# EAGLE design M220p16 (EAGLE 6.6.0)
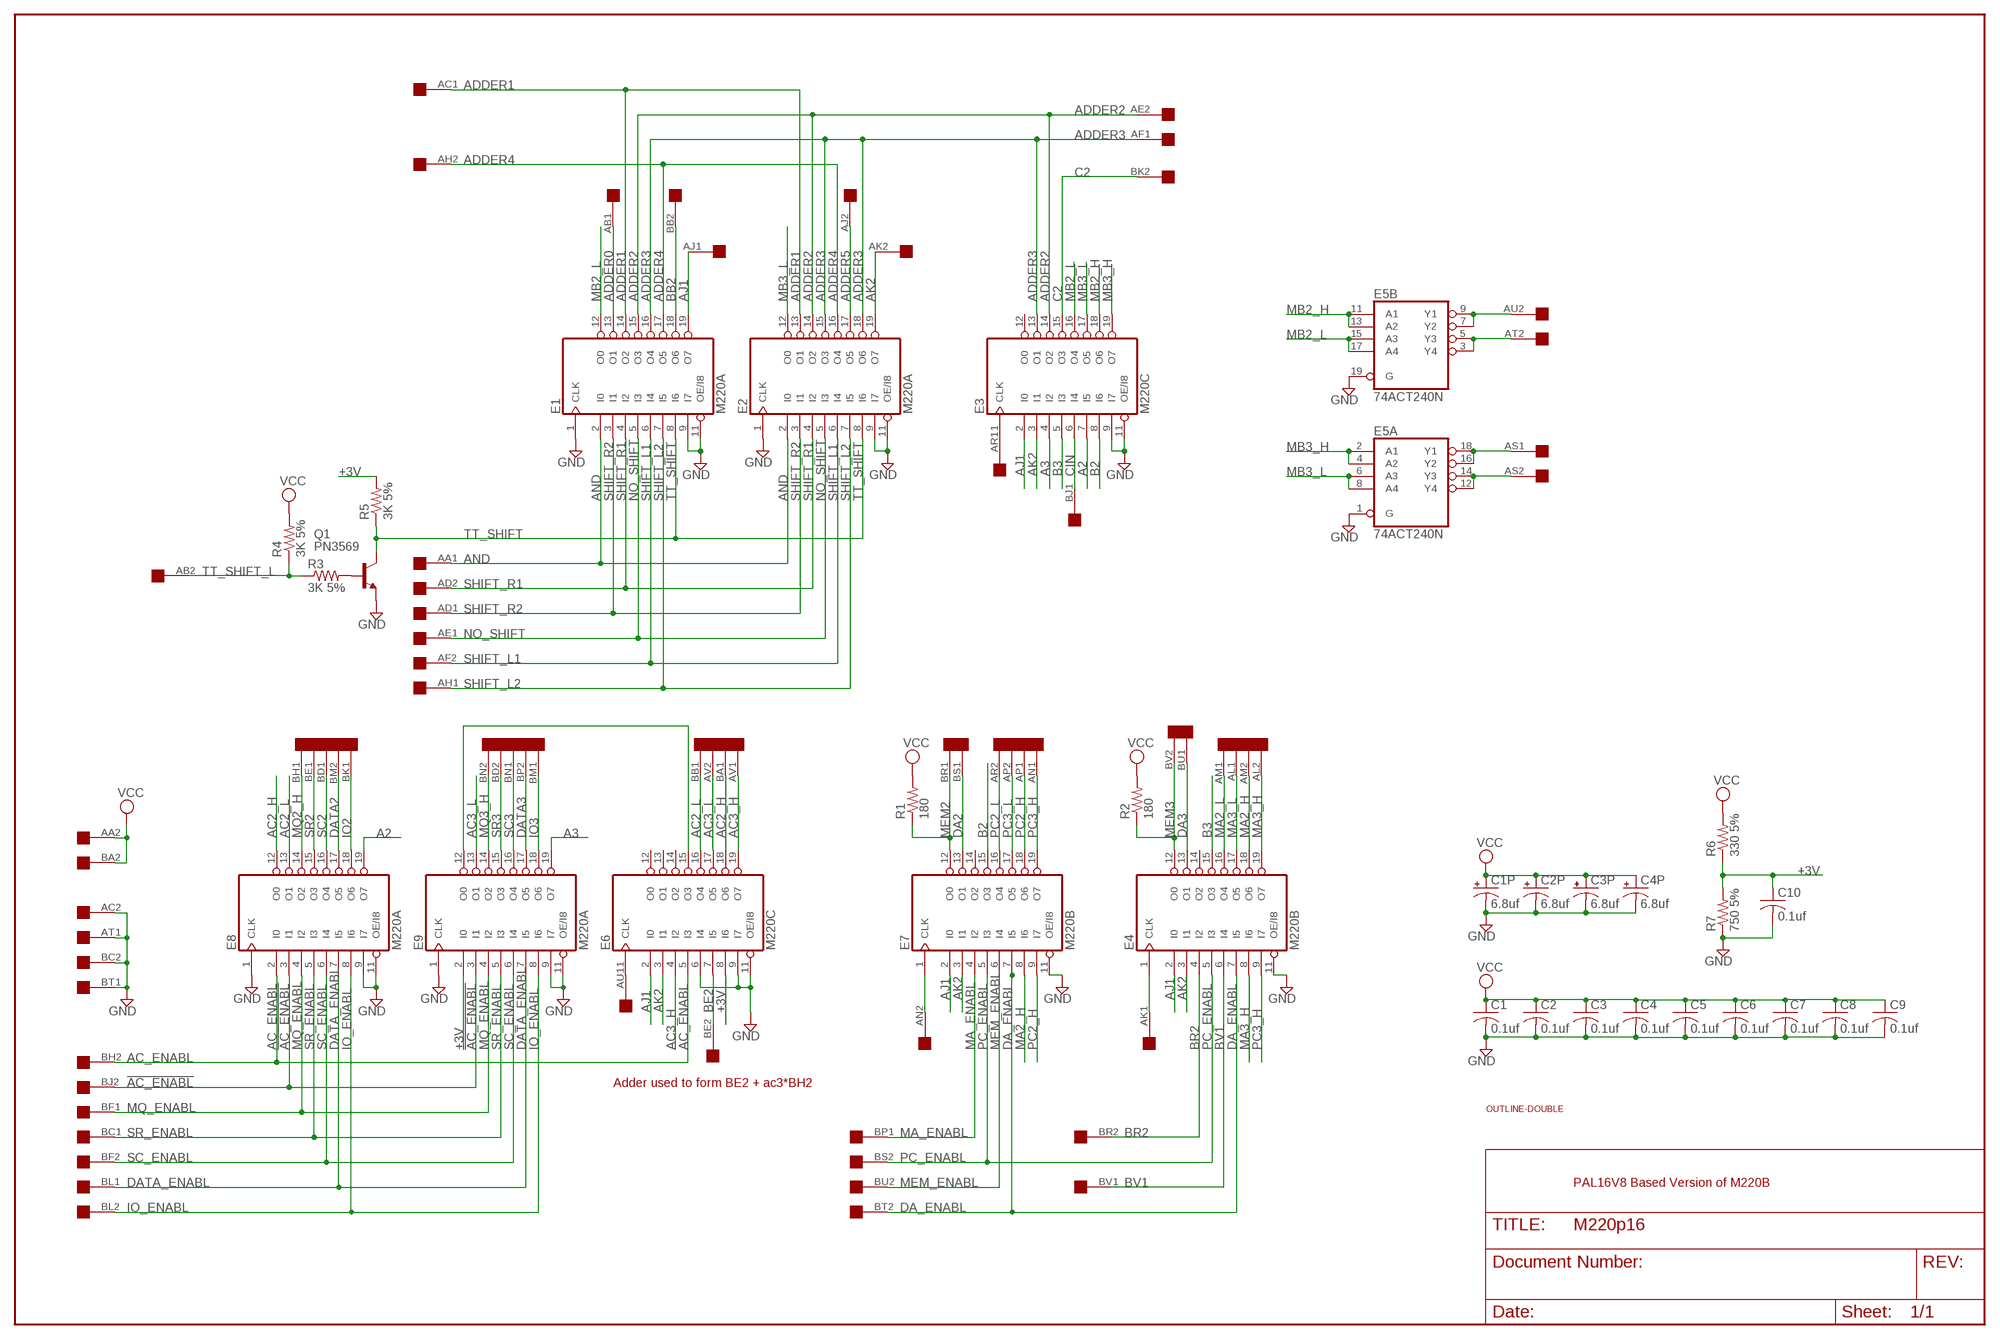
[diagram p0: schematic, sheet 1]

## Parts
C1  0.1uf  C-US050-025X075  [C050-025X075]
C1P  6.8uf  CPOL-USE15-5AXIAL  [E15-5]
C2  0.1uf  C-US050-025X075  [C050-025X075]
C2P  6.8uf  CPOL-USE15-5AXIAL  [E15-5]
C3  0.1uf  C-US050-025X075  [C050-025X075]
C3P  6.8uf  CPOL-USE15-5AXIAL  [E15-5]
C4  0.1uf  C-US050-025X075  [C050-025X075]
C4P  6.8uf  CPOL-USE15-5AXIAL  [E15-5]
C5  0.1uf  C-US050-025X075  [C050-025X075]
C6  0.1uf  C-US050-025X075  [C050-025X075]
C7  0.1uf  C-US050-025X075  [C050-025X075]
C8  0.1uf  C-US050-025X075  [C050-025X075]
C9  0.1uf  C-US050-025X075  [C050-025X075]
C10  0.1uf  C-US050-025X075  [C050-025X075]
E1  M220A  16V8  [DIL20]
E2  M220A  16V8  [DIL20]
E3  M220C  16V8  [DIL20]
E4  M220B  16V8  [DIL20]
E5  74ACT240N  74S240N  [DIL20]
E6  M220C  16V8  [DIL20]
E7  M220B  16V8  [DIL20]
E8  M220A  16V8  [DIL20]
E9  M220A  16V8  [DIL20]
Q1  PN3569  2N2102  [TO5]
R1  180  R-US_0207/10  [0207/10]
R2  180  R-US_0207/10  [0207/10]
R3  3K 5%  R-US_0207/10  [0207/10]
R4  3K 5%  R-US_0207/10  [0207/10]
R5  3K 5%  R-US_0207/10  [0207/10]
R6  330 5%  R-US_0207/10  [0207/10]
R7  750 5%  R-US_0207/10  [0207/10]
U$1  DOUBLE  [EDGE-CON4]
U$2  OUTLINE-DOUBLE  [DOUBLE]

## Nets
!AC_ENABL: E8.3(I1) E9.3(I1) U$1.BJ2
+3V [Supply]: C10.1 E6.8(I6) E9.2(I0) R5.2 R6.1 R7.2
A2: E3.7(I5) E8.19(O7)
A3 [Supply]: E3.4(I2) E9.19(O7)
AC2_H: E6.18(O6) E8.12(O0) U$1.BA1
AC2_L: E6.16(O4) E8.13(O1) U$1.BB1
AC3_H: E6.4(I2) E6.19(O7) U$1.AV1
AC3_L: E6.17(O5) E9.13(O1) U$1.AV2
AC_ENABL: E6.5(I3) E8.2(I0) U$1.BH2
ADDER0: E1.13(O1) U$1.AB1
ADDER1: E1.14(O2) E2.13(O1) U$1.AC1
ADDER2: E1.15(O3) E2.14(O2) E3.14(O2) U$1.AE2
ADDER3: E1.16(O4) E2.15(O3) E2.18(O6) E3.13(O1) U$1.AF1
ADDER4: E1.17(O5) E2.16(O4) U$1.AH2
ADDER5: E2.17(O5) U$1.AJ2
AJ1: E1.19(O7) E3.2(I0) E4.2(I0) E6.2(I0) E7.2(I0) U$1.AJ1
AK2: E2.19(O7) E3.3(I1) E4.3(I1) E6.3(I1) E7.3(I1) U$1.AK2
AND: E1.2(I0) E2.2(I0) U$1.AA1
B2: E3.8(I6) E7.15(O3)
B3: E3.5(I3) E4.15(O3)
BB2: E1.18(O6) U$1.BB2
BE2: E6.7(I5) U$1.BE2
BR2: E4.4(I2) U$1.BR2
BV1: E4.6(I4) U$1.BV1
C2: E3.15(O3) U$1.BK2
CIN: E3.6(I4) U$1.BJ1
DA2: E7.13(O1) U$1.BS1
DA3: E4.13(O1) U$1.BU1
DA_ENABL: E4.7(I5) E7.7(I5) U$1.BT2
DATA2: E8.17(O5) U$1.BM2
DATA3: E9.17(O5) U$1.BP2
DATA_ENABL: E8.7(I5) E9.7(I5) U$1.BL1
GND [Supply]: C1.2 C1P.- C2.2 C2P.- C3.2 C3P.- C4.2 C4P.- C5.2 C6.2 C7.2 C8.2 C9.2 C10.2 E1.1(CLK) E1.9(I7) E1.11(OE/I8) E2.1(CLK) E2.9(I7) E2.11(OE/I8) E3.9(I7) E3.11(OE/I8) E4.11(OE/I8) E5.1(A:G) E5.19(B:G) E6.6(I4) E6.9(I7) E6.11(OE/I8) E7.11(OE/I8) E8.1(CLK) E8.9(I7) E8.11(OE/I8) E9.1(CLK) E9.9(I7) E9.11(OE/I8) Q1.1(E) R7.1 U$1.AC2 U$1.AT1 U$1.BC2 U$1.BT1
IO2: E8.18(O6) U$1.BK1
IO3: E9.18(O6) U$1.BM1
IO_ENABL: E8.8(I6) E9.8(I6) U$1.BL2
MA2_H: E4.18(O6) E7.8(I6) U$1.AM2
MA2_L: E4.16(O4) U$1.AM1
MA3_H: E4.8(I6) E4.19(O7) U$1.AL2
MA3_L: E4.17(O5) U$1.AL1
MA_ENABL: E7.4(I2) U$1.BP1
MB2_H: E3.18(O6) E5.11(B:A1) E5.13(B:A2)
MB2_L: E1.12(O0) E3.16(O4) E5.15(B:A3) E5.17(B:A4)
MB3_H: E3.19(O7) E5.2(A:A1) E5.4(A:A2)
MB3_L: E2.12(O0) E3.17(O5) E5.6(A:A3) E5.8(A:A4)
MEM2: E7.12(O0) R1.1 U$1.BR1
MEM3: E4.12(O0) R2.1 U$1.BV2
MEM_ENABL: E7.6(I4) U$1.BU2
MQ2_H: E8.14(O2) U$1.BH1
MQ3_H: E9.14(O2) U$1.BN2
MQ_ENABL: E8.4(I2) E9.4(I2) U$1.BF1
N$1: E7.1(CLK) U$1.AN2
N$2: E4.1(CLK) U$1.AK1
N$3: E3.1(CLK) U$1.AR1
N$4: E6.1(CLK) U$1.AU1
N$5 [Supply]: E6.15(O3) E9.12(O0)
N$6: E5.12(A:Y4) E5.14(A:Y3) U$1.AS2
N$7: E5.16(A:Y2) E5.18(A:Y1) U$1.AS1
N$8: E5.3(B:Y4) E5.5(B:Y3) U$1.AT2
N$9: E5.7(B:Y2) E5.9(B:Y1) U$1.AU2
N$10: Q1.2(B) R3.2
NO_SHIFT: E1.5(I3) E2.5(I3) U$1.AE1
PC2_H: E7.9(I7) E7.18(O6) U$1.AP1
PC2_L: E7.16(O4) U$1.AR2
PC3_H: E4.9(I7) E7.19(O7) U$1.AN1
PC3_L: E7.17(O5) U$1.AP2
PC_ENABL: E4.5(I3) E7.5(I3) U$1.BS2
SC2: E8.16(O4) U$1.BD1
SC3: E9.16(O4) U$1.BN1
SC_ENABL: E8.6(I4) E9.6(I4) U$1.BF2
SHIFT_L1: E1.6(I4) E2.6(I4) U$1.AF2
SHIFT_L2: E1.7(I5) E2.7(I5) U$1.AH1
SHIFT_R1: E1.4(I2) E2.4(I2) U$1.AD2
SHIFT_R2: E1.3(I1) E2.3(I1) U$1.AD1
SR2: E8.15(O3) U$1.BE1
SR3: E9.15(O3) U$1.BD2
SR_ENABL: E8.5(I3) E9.5(I3) U$1.BC1
TT_SHIFT: E1.8(I6) E2.8(I6) Q1.3(C) R5.1
TT_SHIFT_L: R3.1 R4.1 U$1.AB2
VCC [Supply]: C1.1 C1P.+ C2.1 C2P.+ C3.1 C3P.+ C4.1 C4P.+ C5.1 C6.1 C7.1 C8.1 C9.1 R1.2 R2.2 R4.2 R6.2 U$1.AA2 U$1.BA2
Unconnected: E3.12(O0) E4.14(O2) E6.12(O0) E6.13(O1) E6.14(O2) E7.14(O2)

## Notes on the sheet
- Adder used to form BE2 + ac3*BH2
- PAL16V8 Based Version of M220B

## Power pins joined to a net without a drawn wire
GND: E1.10(GND) E2.10(GND) E3.10(GND) E4.10(GND) E5.10(P:GND) E6.10(GND) E7.10(GND) E8.10(GND) E9.10(GND)
VCC: E1.20(VCC) E2.20(VCC) E3.20(VCC) E4.20(VCC) E5.20(P:VCC) E6.20(VCC) E7.20(VCC) E8.20(VCC) E9.20(VCC)

## Library data of the parts
C1-C10 = rcl:C-US: CAPACITOR, American symbol
C1P C2P C3P C4P = rcl:CPOL-US: POLARIZED CAPACITOR, American symbol
E1-E4 E6-E9 = pal:16V8: PAL; MPN: GAL16V8D-7LPN; OC_FARNELL: 9699740; OC_NEWARK: 97K0449
E5 = 74xx-us:74*240: Octal BUFFER and LINE DRIVER, 3-state
Q1 = transistor:2N2102: NPN TRANSISTOR
R1-R7 = rcl:R-US_: RESISTOR, American symbol
U$1 = dec-con:DOUBLE: Double-Height DEC board
U$2 = dec-con:OUTLINE-*: Board outlines for DEC boards.

## Net classes
1 Supply: width 0.813 mm

## Board
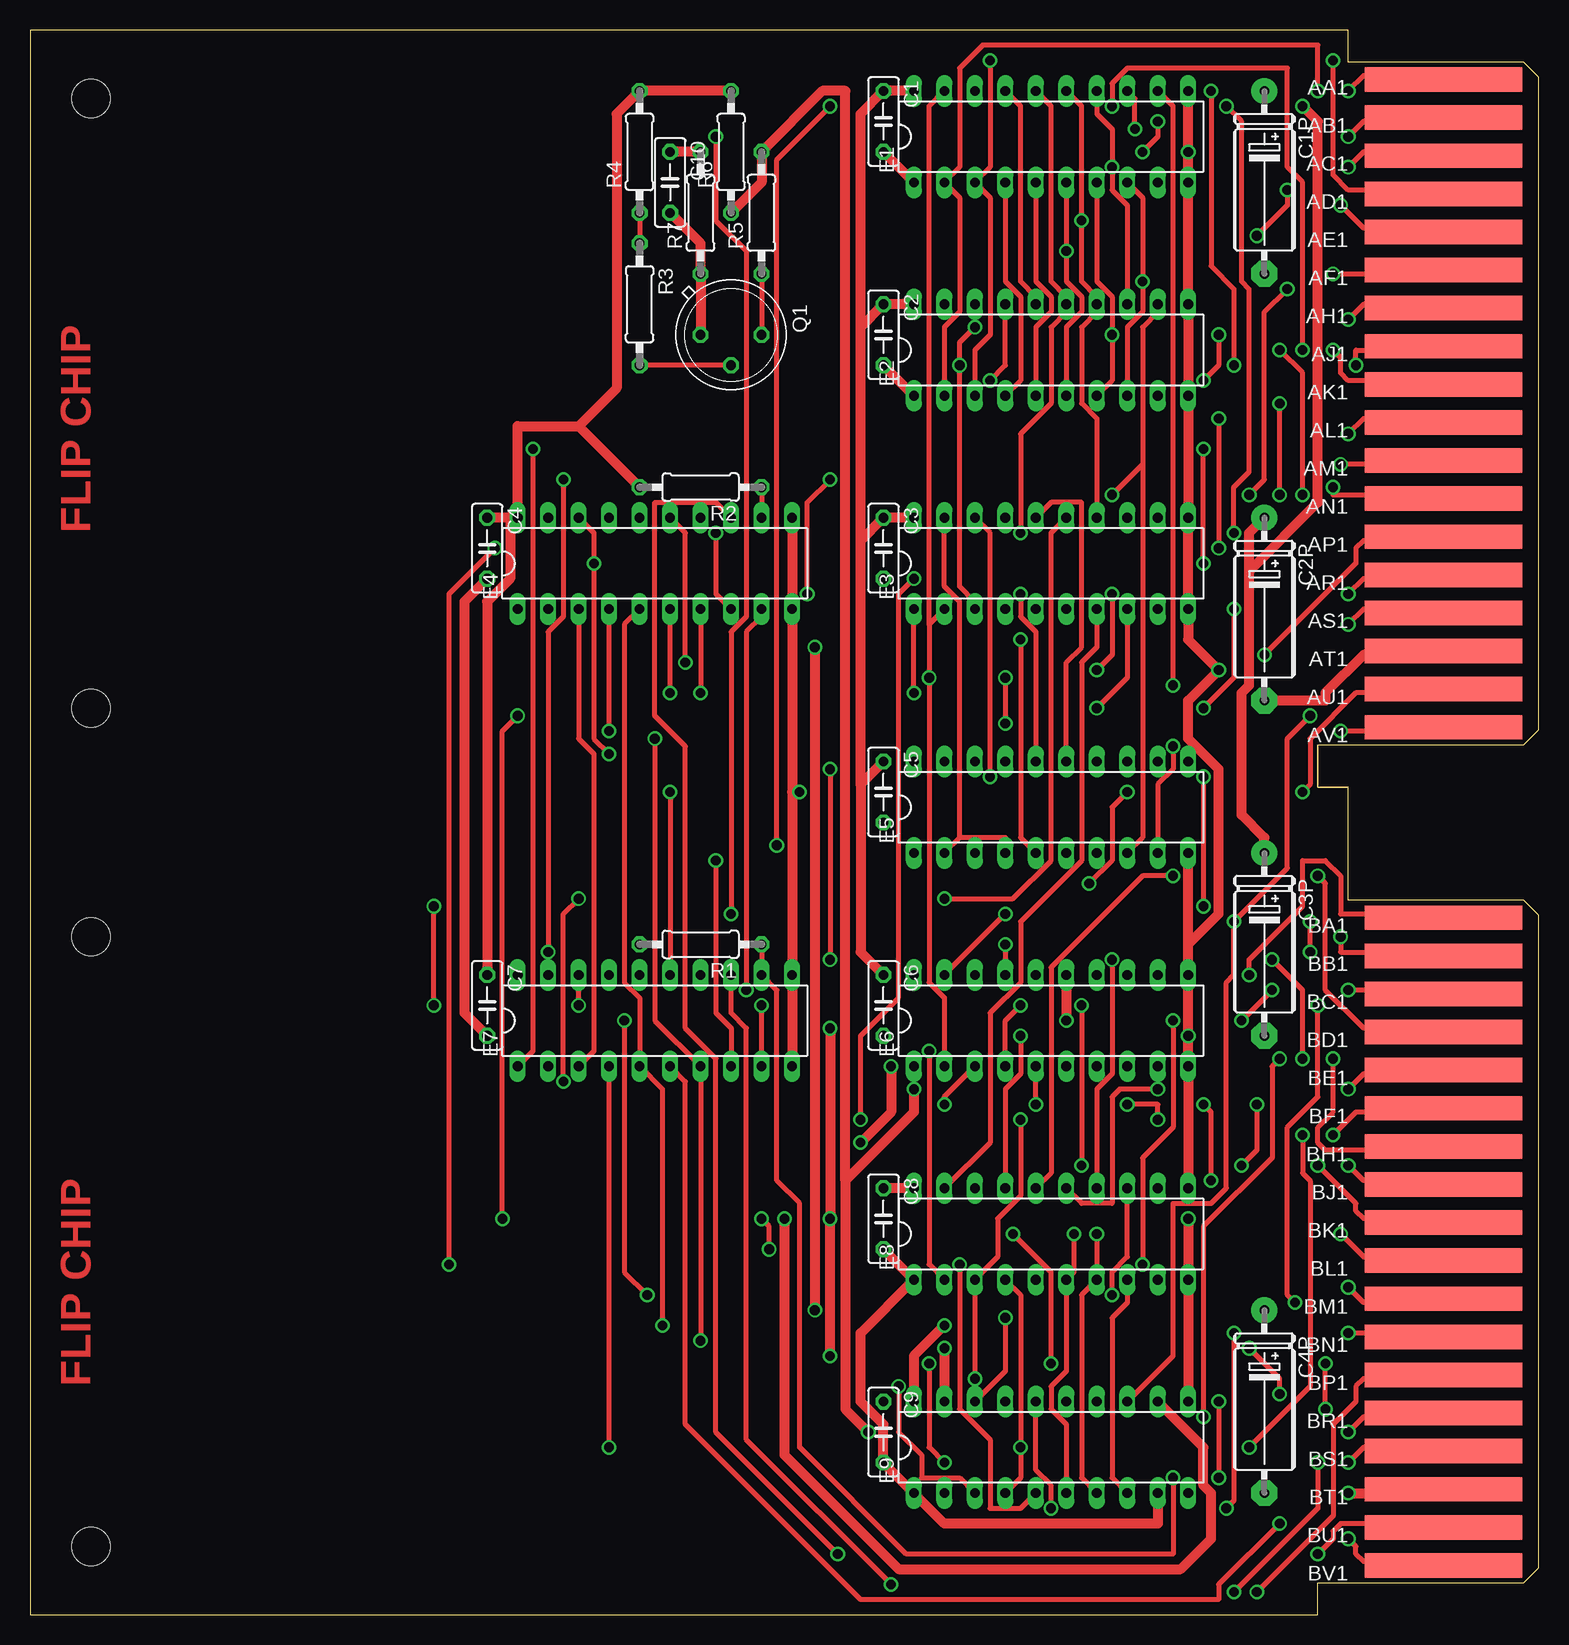
[diagram p1: board, top side]
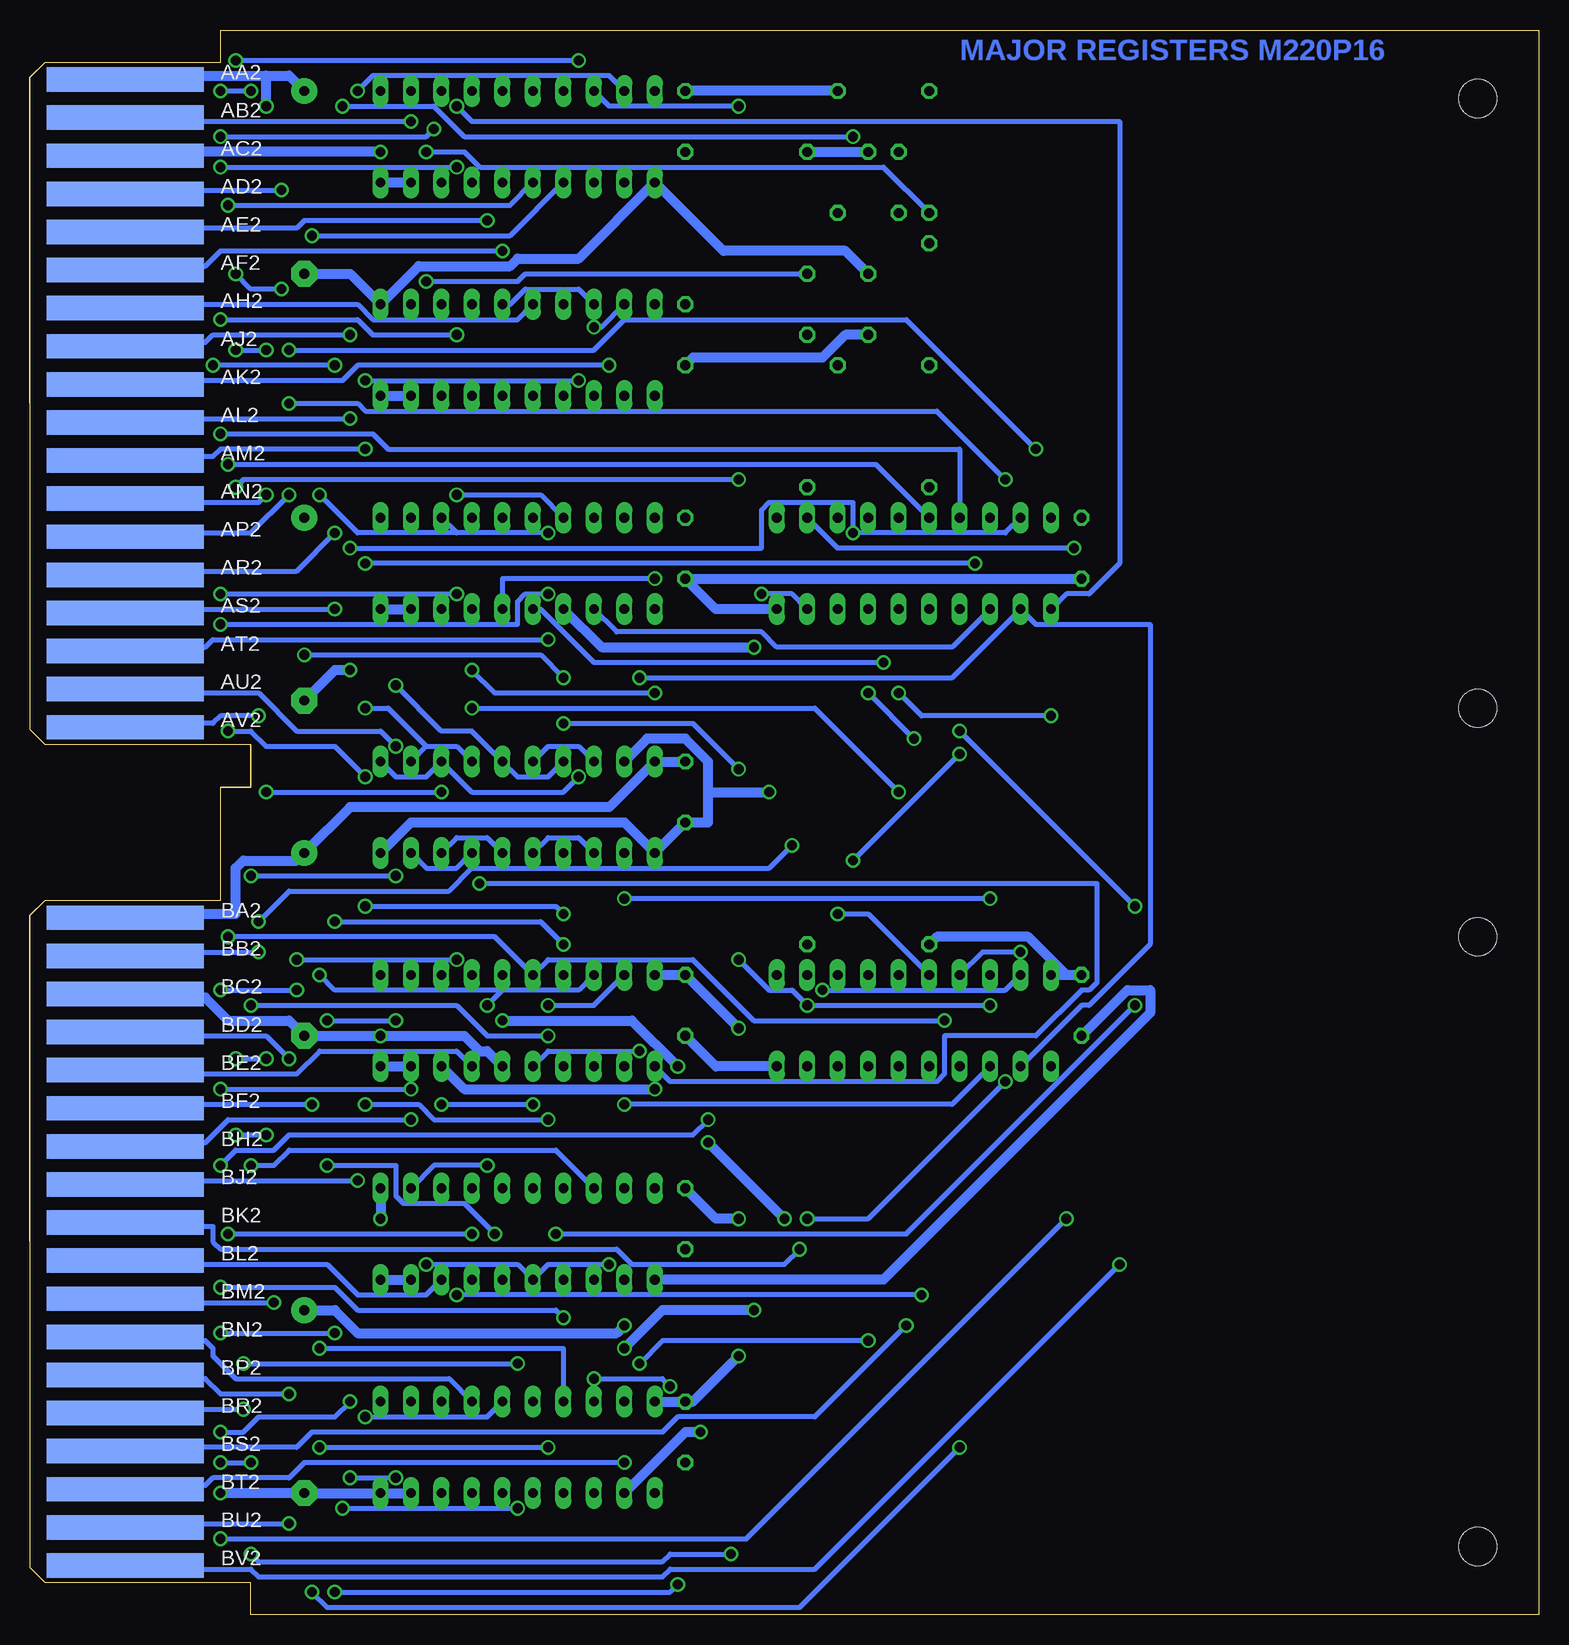
[diagram p2: board, bottom side, seen from below]

Size 125.73 x 132.08 mm. Coordinates in mm from the lower left corner, seen from the top.
Copper layers (1+16): Top 0.035mm / dielectric 1.5mm / Bottom 0.035mm
Design rules "16mils": minimum track width 16mil, minimum drill 32mil, track to track 15mil, track to pad 10mil, pad to pad 10mil, via to via 10mil, smd to smd 10mil, copper to edge 13mil, drill to drill 10mil, minimum pad ring 10mil, minimum via ring 8mil, stop-mask expansion 0mil, vias tented up to drill 0mil, thermal gap 10mil

### Footprints (pad centres in the part's own frame; a part is rotated, then mirrored left to right if it is on the bottom)
C050-025X075 = drill 0.813 octagon: 1 -2.54,0; 2 2.54,0
E15-5 = drill 0.813 pad 2.159: + -7.62,0 | drill 0.813 pad 2.159 octagon: - 7.62,0
DIL20 = drill 0.813 long: 1 -11.43,-3.81; 2 -8.89,-3.81; 3 -6.35,-3.81; 4 -3.81,-3.81; 5 -1.27,-3.81; 6 1.27,-3.81; 7 3.81,-3.81; 8 6.35,-3.81; 9 8.89,-3.81; 10 11.43,-3.81; 11 11.43,3.81; 12 8.89,3.81; 13 6.35,3.81; 14 3.81,3.81; 15 1.27,3.81; 16 -1.27,3.81; 17 -3.81,3.81; 18 -6.35,3.81; 19 -8.89,3.81; 20 -11.43,3.81
TO5 = drill 0.813 octagon: 1 0,-2.54; 2 2.54,0; 3 0,2.54
0207/10 = drill 0.813 octagon: 1 -5.08,0; 2 5.08,0
EDGE-CON4 = smd 13.106 x 2.032: AA1 7.938,4.128; AB1 7.938,7.303; AC1 7.938,10.477; AD1 7.938,13.652; AE1 7.938,16.828; AF1 7.938,20.003; AH1 7.938,23.177; AJ1 7.938,26.352; AK1 7.938,29.527; AL1 7.938,32.703; AM1 7.938,35.877; AN1 7.938,39.053; AP1 7.938,42.227; AR1 7.938,45.403; AS1 7.938,48.578; AT1 7.938,51.752; AU1 7.938,54.928; AV1 7.938,58.102; BA1 7.938,73.978; BB1 7.938,77.153; BC1 7.938,80.328; BD1 7.938,83.502; BE1 7.938,86.677; BF1 7.938,89.853; BH1 7.938,93.028; BJ1 7.938,96.203; BK1 7.938,99.377; BL1 7.938,102.552; BM1 7.938,105.728; BN1 7.938,108.903; BP1 7.938,112.078; BR1 7.938,115.252; BS1 7.938,118.427; BT1 7.938,121.603; BU1 7.938,124.778; BV1 7.938,127.953 | smd 13.106 x 2.032 bottom: AA2 7.938,4.128; AB2 7.938,7.303; AC2 7.938,10.477; AD2 7.938,13.652; AE2 7.938,16.828; AF2 7.938,20.003; AH2 7.938,23.177; AJ2 7.938,26.352; AK2 7.938,29.527; AL2 7.938,32.703; AM2 7.938,35.877; AN2 7.938,39.053; AP2 7.938,42.227; AR2 7.938,45.403; AS2 7.938,48.578; AT2 7.938,51.752; AU2 7.938,54.928; AV2 7.938,58.102; BA2 7.938,73.978; BB2 7.938,77.153; BC2 7.938,80.328; BD2 7.938,83.502; BE2 7.938,86.677; BF2 7.938,89.853; BH2 7.938,93.028; BJ2 7.938,96.203; BK2 7.938,99.377; BL2 7.938,102.552; BM2 7.938,105.728; BN2 7.938,108.903; BP2 7.938,112.078; BR2 7.938,115.252; BS2 7.938,118.427; BT2 7.938,121.603; BU2 7.938,124.778; BV2 7.938,127.953
DOUBLE = hole 3.175: 120.65,56.515; 120.65,5.715; 120.65,75.565; 120.65,126.365

### Placement (x,y rotation side)
C1  71.12,124.46 270 top
C1P  102.87,119.38 270 top
C2  71.12,106.68 270 top
C2P  102.87,83.82 270 top
C3  71.12,88.9 270 top
C3P  102.87,55.88 270 top
C4  38.1,88.9 270 top
C4P  102.87,17.78 270 top
C5  71.12,68.58 270 top
C6  71.12,50.8 270 top
C7  38.1,50.8 270 top
C8  71.12,33.02 270 top
C9  71.12,15.24 270 top
C10  53.34,119.38 270 top
E1  85.09,123.19 0 top
E2  85.09,105.41 0 top
E3  85.09,87.63 0 top
E4  52.07,87.63 0 top
E5  85.09,67.31 0 top
E6  85.09,49.53 0 top
E7  52.07,49.53 0 top
E8  85.09,31.75 0 top
E9  85.09,13.97 0 top
Q1  58.42,106.68 270 top
R1  55.88,55.88 180 top
R2  55.88,93.98 180 top
R3  50.8,109.22 270 top
R4  50.8,121.92 90 top
R5  60.96,116.84 90 top
R6  58.42,121.92 90 top
R7  55.88,116.84 90 top
U$1  125.73,132.08 180 top
U$2  125.73,132.08 180 top
U$3  [FLIPCHIP]  0,0 0 top
U$4  [FLIPCHIP]  0,71.12 0 top

### Tracks (layer width: path | path; a pad name or v marks a point on that pad's centre or on a via)
!AC_ENABL  (via drill 0.81)
  Top 0.406: E9.3 77.47,11.43 74.3,11.43 74.3,13.34 72.39,15.24 v72.39,19.05 | v78.74,19.68 E8.3 80.64,29.84 80.64,33.02 82.55,34.92 v82.55,41.27 | v97.79,42.55 98.42,41.91 v98.42,36.2
  Bottom 0.406: v72.39,19.05 73.03,19.68 v78.74,19.68 | v82.55,41.27 92.08,41.27 93.34,42.55 v97.79,42.55 | v98.42,36.2 117.47,36.2 U$1.BJ2
+3V  (via drill 0.81)
  Top 0.813: R7.2 C10.1 | R6.1 60.96,119.38 R5.2 66.04,127 67.94,127 67.94,36.2 | v69.85,15.24 67.94,17.14 67.94,36.2 | 67.94,36.2 73.66,41.91 v73.66,43.81
  Bottom 0.813: R5.2 R7.2 | E9.2 71.12,15.24 v69.85,15.24 | v73.66,43.81 89.53,43.81 E6.8
A2
  Top 0.406: E8.19 80.01,39.37 80.01,50.16 82.55,52.7 82.55,57.78 87.63,62.87 87.63,79.38 88.9,80.64 E3.7
A3  (via drill 0.81)
  Top 0.813: v76.2,22.23 E9.19 | v65.41,80.64 v65.41,25.4
  Bottom 0.813: v76.2,22.23 73.03,25.4 v65.41,25.4 | v65.41,80.64 78.11,80.64 E3.4
AC2_H  (via drill 0.81)
  Top 0.406: v87.63,50.8 v87.63,37.47 | v101.6,53.34 101.6,54.61 106.05,59.05 106.05,62.87 107.95,62.87 109.22,61.59 109.22,58.42 117.47,58.42 U$1.BA1
  Bottom 0.406: E8.12 92.08,37.47 v87.63,37.47 | 86.36,52.07 v87.63,50.8 | 86.36,52.07 80.01,52.07 E6.18 | v101.6,53.34 100.33,52.07 86.36,52.07
AC2_L  (via drill 0.81)
  Top 0.406: E8.13 91.44,29.84 90.17,28.57 v90.17,26.67 | v51.44,26.67 49.53,28.57 v49.53,49.53 | v109.22,56.52 109.22,55.24 117.47,55.24 U$1.BB1
  Bottom 0.406: v51.44,26.67 v90.17,26.67 | v49.53,49.53 65.41,49.53 70.48,54.61 82.55,54.61 E6.16 87,56.52 v109.22,56.52
AC3_H  (via drill 0.81)
  Top 0.406: v82.55,50.8 81.28,49.53 E6.4 | v81.28,58.42 E6.19 | v97.79,69.85 v97.79,59.05 | v109.22,73.66 117.47,73.66 U$1.AV1
  Bottom 0.406: E6.19 78.74,50.8 v82.55,50.8 | v81.28,58.42 81.92,59.05 v97.79,59.05 | v97.79,69.85 100.33,72.39 106.05,72.39 107.31,73.66 v109.22,73.66
AC3_L  (via drill 0.81)
  Top 0.406: v81.28,55.88 E6.17 | E9.13 95.25,21.59 95.25,34.29 98.42,34.29 99.69,35.56 99.69,52.7 100.33,53.34 v100.33,57.78 104.78,62.23 104.78,73.03 v106.68,74.93
  Bottom 0.406: v81.28,55.88 83.19,57.78 v100.33,57.78 | v106.68,74.93 109.86,74.93 110.49,74.3 117.47,74.3 U$1.AV2
AC_ENABL  (via drill 0.81)
  Top 0.406: E8.2 74.93,29.21 v74.93,46.99 | v83.82,42.55 E6.5 | v91.44,42.55 93.98,42.55 v93.98,41.27
  Bottom 0.406: v74.93,46.99 82.55,46.99 E6.5 | v91.44,42.55 v83.82,42.55 | v93.98,41.27 109.22,41.27 111.12,39.37 117.47,39.37 U$1.BH2
ADDER0  (via drill 0.81)
  Top 0.406: E1.13 92.08,126.36 v92.08,123.83 | v109.86,123.19 111.12,124.46 117.47,124.46 U$1.AB1
  Bottom 0.406: v92.08,123.83 92.71,123.19 v109.86,123.19
ADDER1  (via drill 0.81)
  Top 0.406: E2.13 91.44,117.47 90.17,118.75 v90.17,120.65 90.17,123.83 88.9,125.09 E1.14 | v109.86,120.65 111.12,121.92 117.47,121.92 U$1.AC1
  Bottom 0.406: v109.86,120.65 v90.17,120.65
ADDER2  (via drill 0.81)
  Top 0.406: E3.14 88.9,99.69 87.63,100.97 87.63,107.31 88.9,108.58 E2.14 88.9,109.86 87.63,111.12 v87.63,116.2 87.63,125.73 E1.15
  Bottom 0.406: v87.63,116.2 102.87,116.2 103.5,115.57 117.47,115.57 U$1.AE2
ADDER3  (via drill 0.81)
  Top 0.406: v82.55,90.17 82.55,98.42 85.09,100.97 85.09,107.31 86.36,108.58 E2.15 86.36,109.86 85.09,111.12 85.09,125.73 E1.16 | v108.58,111.76 117.47,111.76 U$1.AF1 | v104.78,110.49 102.87,108.58 102.87,94.61 v101.6,93.34
  Bottom 0.406: E2.18 80.01,110.49 84.45,110.49 85.72,109.22 E2.15 | 90.17,90.17 E3.13 | v82.55,90.17 90.17,90.17 | v108.58,111.76 107.31,110.49 v104.78,110.49 | v101.6,93.34 98.42,90.17 90.17,90.17
ADDER4
  Top 0.406: E1.17 82.55,125.73 82.55,111.12 83.82,109.86 E2.16
  Bottom 0.406: E2.16 85.09,107.95 97.16,107.95 98.42,109.22 117.47,109.22 U$1.AH2
ADDER5  (via drill 0.81)
  Top 0.406: E2.17 81.28,104.14 v80.01,102.87 | v97.79,102.87 99.06,104.14 v99.06,106.68
  Bottom 0.406: v97.79,102.87 v80.01,102.87 | v99.06,106.68 110.49,106.68 111.12,106.05 117.47,106.05 U$1.AJ2
AJ1  (via drill 0.81)
  Top 0.406: E6.2 76.2,51.44 74.93,52.7 v74.93,78.11 74.93,82.55 | E3.2 74.93,82.55 | E1.19 74.93,125.73 74.93,82.55 | v110.49,104.14 110.49,105.41 117.47,105.41 U$1.AJ1 | v100.33,104.14 100.33,110.49 98.42,112.39 v98.42,127
  Bottom 0.406: E7.2 38.1,50.8 37.47,50.8 32.38,55.88 32.38,82.55 41.91,82.55 E4.2 48.9,78.11 v74.93,78.11 | v100.33,104.14 v110.49,104.14 | v98.42,127 97.16,128.27 77.47,128.27 E1.19
AK2  (via drill 0.81)
  Top 0.406: E7.3 46.99,46.99 46.99,71.75 45.72,73.03 E4.3 | E6.3 76.2,43.18 v76.2,42.55 | v78.74,107.31 77.47,106.05 v77.47,104.14 77.47,85.72 78.74,84.45 E3.3
  Bottom 0.406: v76.2,42.55 48.9,42.55 E7.3 | E3.3 76.83,81.92 64.77,81.92 63.5,80.64 48.9,80.64 E4.3 | E2.19 78.11,107.31 v78.74,107.31 | v77.47,104.14 98.42,104.14 99.69,102.87 117.47,102.87 U$1.AK2
AND  (via drill 0.81)
  Top 0.406: E2.2 76.2,107.31 77.47,108.58 77.47,118.11 E1.2 77.47,120.65 77.47,128.91 79.38,130.81 107.31,130.81 v107.31,127 | v109.86,127 111.12,128.27 117.47,128.27 U$1.AA1
  Bottom 0.406: v109.86,127 v107.31,127
B2  (via drill 0.81)
  Top 0.406: v53.34,68.58 E7.15 | v88.9,75.56 91.44,78.11 E3.8
  Bottom 0.406: v53.34,68.58 60.33,75.56 v88.9,75.56
B3  (via drill 0.81)
  Top 0.406: E4.15 54.61,90.17 v54.61,79.38
  Bottom 0.406: v54.61,79.38 78.74,79.38 83.19,83.82 E3.5
BB2  (via drill 0.81)
  Top 0.406: v66.67,125.73 62.23,121.28 v62.23,64.14 | v106.68,55.24 v106.68,57.78
  Bottom 0.406: E1.18 77.47,125.73 v66.67,125.73 | v62.23,64.14 64.14,62.23 88.9,62.23 90.81,60.33 104.14,60.33 v106.68,57.78 | v106.68,55.24 117.47,55.24 U$1.BB2
BE2
  Bottom 0.406: E6.7 90.17,46.99 101.6,46.99 103.5,45.09 117.47,45.09 U$1.BE2
BR2  (via drill 0.81)
  Top 0.406: v48.26,73.66 E4.4 | v33.66,50.8 v33.66,59.05 | v81.92,31.75 85.09,28.57 v85.09,20.95 | v107.95,17.14 v107.95,20.95
  Bottom 0.406: v33.66,59.05 v48.26,73.66 | v33.66,50.8 52.7,31.75 v81.92,31.75 | v107.95,20.95 v85.09,20.95 | v107.95,17.14 117.47,17.14 U$1.BR2
BV1  (via drill 0.81)
  Top 0.406: v53.34,76.83 E4.6 | v40.64,74.93 39.37,73.66 v39.37,33.02 | v109.86,6.35 110.49,5.71 110.49,5.08 111.12,4.45 117.47,4.45 U$1.BV1
  Bottom 0.406: v53.34,76.83 51.44,74.93 v40.64,74.93 | v39.37,33.02 66.04,6.35 v109.86,6.35
C2  (via drill 0.81)
  Top 0.406: E3.15 85.09,90.17 85.09,62.87 81.92,59.69 v76.2,59.69 | v45.72,59.69 44.45,58.42 v44.45,44.45 | v60.96,33.02 61.59,32.38 v61.59,30.48
  Bottom 0.406: v45.72,59.69 v76.2,59.69 | v44.45,44.45 55.88,33.02 v60.96,33.02 | v61.59,30.48 62.87,29.21 75.56,29.21 76.83,30.48 109.86,30.48 110.49,31.11 110.49,32.38 117.47,32.38 U$1.BK2
CIN  (via drill 0.81)
  Top 0.406: v73.66,86.36 72.39,85.09 72.39,51.44 69.22,48.26 v69.22,41.27 | v109.86,37.47 111.12,36.2 117.47,36.2 U$1.BJ1
  Bottom 0.406: E3.6 86.36,86.36 v73.66,86.36 | v69.22,41.27 70.48,40.01 104.14,40.01 105.41,38.73 108.58,38.73 v109.86,37.47
DA2  (via drill 0.81)
  Top 0.406: E7.13 58.42,50.16 59.69,48.9 59.69,14.61 v71.75,2.54 | v100.33,1.91 107.31,8.89 v107.31,12.7 | v109.86,12.7 111.12,13.97 117.47,13.97 U$1.BS1
  Bottom 0.406: v71.75,2.54 72.39,1.91 v100.33,1.91 | v109.86,12.7 v107.31,12.7
DA3  (via drill 0.81)
  Top 0.406: E4.13 57.15,92.71 52.07,92.71 52.07,74.93 54.61,72.39 54.61,48.9 57.15,46.35 57.15,15.24 v67.31,5.08 | v107.31,5.08 108.58,6.35 108.58,6.99 109.22,7.62 117.47,7.62 U$1.BU1
  Bottom 0.406: v67.31,5.08 72.39,5.08 73.03,4.45 106.68,4.45 v107.31,5.08
DA_ENABL  (via drill 0.81)
  Top 0.406: v52.07,73.03 52.07,49.53 E7.7 v55.88,22.86 | E4.7 v55.88,76.83 | v76.2,12.7 74.93,13.97 v74.93,20.95
  Bottom 0.406: v55.88,76.83 v52.07,73.03 | v76.2,12.7 102.87,12.7 104.14,11.43 110.49,11.43 111.12,10.79 117.47,10.79 U$1.BT2 | v74.93,20.95 73.03,22.86 v55.88,22.86
DATA2  (via drill 0.81)
  Top 0.406: E8.17 81.28,43.81 82.55,45.09 v82.55,48.26 | v107.31,50.8 107.31,43.18 104.78,40.64 104.78,26.67 v105.41,26.04
  Bottom 0.406: v82.55,48.26 87.63,48.26 90.17,50.8 v107.31,50.8 | v105.41,26.04 117.47,26.04 U$1.BM2
DATA3  (via drill 0.81)
  Top 0.406: v101.6,22.23 104.14,19.68 v104.14,18.41
  Bottom 0.406: E9.17 81.28,22.23 v101.6,22.23 | v104.14,18.41 109.86,18.41 111.12,19.68 117.47,19.68 U$1.BP2
DATA_ENABL  (via drill 0.81)
  Top 0.406: E9.7 87.63,11.43 87.63,26.67 E8.7 v88.9,31.75 | v109.22,31.75 111.12,29.84 117.47,29.84 U$1.BL1
  Bottom 0.406: v109.22,31.75 v88.9,31.75
GND  (via drill 0.81)
  Top 0.813: C1.2 E1.1 | C2.2 E2.1 | Q1.1 R7.1 55.88,114.3 C10.2 | C2P.- 107.95,76.2 107.95,76.83 111.12,80.01 117.47,80.01 U$1.AT1 | E1.11 v96.52,121.92 E1.10 E2.11 E2.10 E3.11 E3.10 96.52,81.28 v99.06,78.74 96.52,76.2 96.52,73.03 99.06,70.48 99.06,58.42 96.52,55.88 | C8.2 E8.1 69.22,23.5 69.22,17.78 71.12,15.88 C9.2 E9.1 76.2,7.62 93.98,7.62 E9.9 | v109.86,10.16 117.47,10.16 U$1.BT1 | C7.2 36.2,50.16 36.2,84.45 C4.2 | E7.10 E7.11 63.5,68.58 | E4.11 E4.10 63.5,68.58 | E9.11 E8.10 v96.52,33.02 | E8.11 E6.10 v96.52,48.26 E6.11 96.52,55.88 | 96.52,55.88 E5.10 | v64.14,68.58 63.5,68.58
  Bottom 0.813: C2.2 70.48,104.78 59.69,104.78 57.78,106.68 Q1.1 | R7.1 57.78,113.67 67.94,113.67 E1.1 80.01,113.03 85.09,113.03 85.72,112.39 93.34,112.39 E2.11 99.06,111.76 C1P.- | E1.10 E1.9 | E3.10 E3.9 | E2.10 E2.9 | v96.52,121.92 117.47,121.92 U$1.AC2 | C2P.- 100.33,78.74 v99.06,78.74 | E9.9 E9.10 C4P.- v109.86,10.16 | C6.2 68.58,45.72 E7.10 | E4.10 68.58,83.82 C3.2 C4.2 | E6.6 87.63,46.99 88.27,46.99 89.53,48.26 v96.52,48.26 C3P.- 104.14,49.53 109.22,49.53 111.12,51.44 117.47,51.44 U$1.BC2 | E5.19 74.3,73.03 71.12,73.03 69.22,71.12 69.22,68.58 | 69.22,68.58 69.22,66.04 C5.2 E5.1 76.2,66.04 93.98,66.04 E5.10 | E8.10 E8.9 | E6.10 E6.9 | E8.11 v96.52,33.02 | 69.22,68.58 v64.14,68.58 | E8.1 54.61,27.94 32.38,50.16 32.38,52.07 34.29,52.07 C7.2
IO2  (via drill 0.81)
  Top 0.406: v107.31,37.47 110.49,34.29 110.49,33.66 111.12,33.02 117.47,33.02 U$1.BK1
  Bottom 0.406: E8.18 81.92,38.73 104.14,38.73 105.41,37.47 v107.31,37.47
IO3  (via drill 0.81)
  Top 0.406: E9.18 81.28,20.32 v81.28,24.77 | v109.86,27.3 111.12,26.04 117.47,26.04 U$1.BM1
  Bottom 0.406: v81.28,24.77 81.92,25.4 98.42,25.4 100.33,27.3 v109.86,27.3
IO_ENABL
  Top 0.406: E9.8 90.17,11.43 90.17,24.77 91.44,26.04 E8.8
  Bottom 0.406: E8.8 92.71,26.67 98.42,26.67 100.97,29.21 117.47,29.21 U$1.BL2
MA2_H  (via drill 0.81)
  Top 0.406: E7.8 58.42,48.9 57.15,50.16 v57.15,62.87 | v48.26,71.75 46.99,73.03 v46.99,87.63 46.99,90.17 E4.18 | v97.79,87.63 v97.79,97.16
  Bottom 0.406: v48.26,71.75 v57.15,62.87 | v97.79,97.16 109.86,97.16 110.49,96.52 117.47,96.52 U$1.AM2 | v46.99,87.63 v97.79,87.63
MA2_L  (via drill 0.81)
  Top 0.406: v109.22,95.89 117.47,95.89 U$1.AM1
  Bottom 0.406: E4.16 55.24,95.89 v109.22,95.89
MA3_H  (via drill 0.81)
  Top 0.406: E4.8 57.15,85.09 v57.15,90.17 | v99.06,99.69 v99.06,88.9
  Bottom 0.406: E4.19 44.45,90.17 v57.15,90.17 57.15,92.71 64.14,92.71 64.77,92.08 64.77,88.9 v99.06,88.9 | v99.06,99.69 117.47,99.69 U$1.AL2
MA3_L  (via drill 0.81)
  Top 0.406: v109.86,98.42 111.12,99.69 117.47,99.69 U$1.AL1
  Bottom 0.406: E4.17 48.26,97.16 95.89,97.16 97.16,98.42 v109.86,98.42
MA_ENABL  (via drill 0.81)
  Top 0.406: v48.26,13.97 E7.4 | v102.23,1.91 108.58,8.26 108.58,15.88 110.49,17.78 110.49,19.05 111.12,19.68 117.47,19.68 U$1.BP1
  Bottom 0.406: v48.26,13.97 61.59,0.64 100.97,0.64 v102.23,1.91
MB2_H  (via drill 0.81)
  Top 0.406: E3.18 80.01,90.17 v80.01,69.85
  Bottom 0.406: E5.11 95.25,69.85 92.71,69.85 E5.13 88.9,68.58 81.28,68.58 v80.01,69.85
MB2_L  (via drill 0.81)
  Top 0.406: E3.16 85.09,92.71 87.63,92.71 87.63,80.64 86.36,79.38 E5.15 | E1.12 95.25,125.73 v95.25,77.47
  Bottom 0.406: E5.17 82.55,69.85 85.09,69.85 E5.15 88.9,73.66 91.44,73.66 v95.25,77.47
MB3_H
  Top 0.406: 77.47,64.77 E5.2 | 77.47,64.77 81.28,64.77 E5.4 | E3.19 76.2,85.72 77.47,84.45 77.47,64.77
MB3_L  (via drill 0.81)
  Top 0.406: 92.71,95.89 v90.17,93.34 | 92.71,95.89 92.71,107.31 93.98,108.58 E2.12 | E5.8 92.71,64.77 92.71,95.89
  Bottom 0.406: E5.6 87.63,64.77 90.17,64.77 E5.8 | E3.17 83.19,93.34 v90.17,93.34
MEM2  (via drill 0.81)
  Top 0.406: R1.1 E7.12 62.23,52.07 62.23,36.2 64.14,34.29 64.14,13.97 73.03,5.08 95.25,5.08 v95.25,11.43 | v99.06,17.78 v99.06,11.43 | v109.86,15.24 111.12,16.51 117.47,16.51 U$1.BR1
  Bottom 0.406: v99.06,11.43 v95.25,11.43 | v99.06,17.78 100.33,16.51 106.68,16.51 107.95,15.24 v109.86,15.24
MEM3  (via drill 0.81)
  Top 0.406: R2.1 E4.12 | v38.73,88.9 34.92,85.09 v34.92,29.21
  Bottom 0.406: E4.12 58.42,88.9 v38.73,88.9 | v34.92,29.21 60.33,3.81 72.39,3.81 73.03,3.17 106.68,3.17 107.31,3.81 117.47,3.81 U$1.BV2
MEM_ENABL  (via drill 0.81)
  Top 0.406: E7.6 54.61,44.45 54.61,15.88 69.22,1.27 99.06,1.27 99.06,2.54 v104.14,7.62
  Bottom 0.406: v104.14,7.62 117.47,7.62 U$1.BU2
MQ2_H  (via drill 0.81)
  Top 0.406: E8.14 88.9,43.81 90.17,45.09 v90.17,54.61 | v103.5,54.61 106.05,52.07 v106.05,46.35 | v108.58,46.35 108.58,41.91 107.31,40.64 107.31,39.37 107.95,38.73 117.47,38.73 U$1.BH1
  Bottom 0.406: v103.5,54.61 v90.17,54.61 | v108.58,46.35 v106.05,46.35
MQ3_H
  Bottom 0.406: E9.14 90.81,19.68 108.58,19.68 110.49,21.59 110.49,22.23 111.12,22.86 117.47,22.86 U$1.BN2
MQ_ENABL  (via drill 0.81)
  Top 0.406: E9.4 82.55,11.43 v82.55,13.97 82.55,26.67 E8.4 | v101.6,13.97 106.68,19.05 106.68,36.2 106.05,36.83 v106.05,40.01 | v108.58,40.01 110.49,41.91 117.47,41.91 U$1.BF1
  Bottom 0.406: v101.6,13.97 v82.55,13.97 | v108.58,40.01 v106.05,40.01
N$1  (via drill 0.81)
  Top 0.406: E7.1 41.91,46.99 v41.91,97.16 | v104.14,105.41 106.05,103.5 v106.05,93.34
  Bottom 0.406: v41.91,97.16 52.7,107.95 76.2,107.95 78.74,105.41 v104.14,105.41 | v106.05,93.34 106.68,92.71 117.47,92.71 U$1.AN2
N$2  (via drill 0.81)
  Top 0.406: v90.17,125.73 90.17,127.64 91.44,128.91 104.78,128.91 104.78,120.65 106.05,119.38 v106.05,105.41 | v108.58,105.41 109.22,104.78 109.22,103.5 109.86,102.87 117.47,102.87 U$1.AK1
  Bottom 0.406: E4.1 39.37,85.09 37.47,85.09 34.92,87.63 34.92,124.46 88.9,124.46 v90.17,125.73 | v108.58,105.41 v106.05,105.41
N$3  (via drill 0.81)
  Top 0.406: v73.66,76.83 E3.1 | v88.9,78.74 90.17,80.01 v90.17,85.09 | v109.86,85.09 111.12,86.36 117.47,86.36 U$1.AR1
  Bottom 0.406: v73.66,76.83 87,76.83 v88.9,78.74 | v109.86,85.09 v90.17,85.09
N$4  (via drill 0.81)
  Top 0.406: v88.27,60.96 90.17,62.87 90.17,67.31 v91.44,68.58 | v106.05,68.58 106.68,69.22 106.68,73.03 110.49,76.83 117.47,76.83 U$1.AU1
  Bottom 0.406: E6.1 72.39,44.45 50.16,44.45 49.53,45.09 49.53,48.26 41.91,48.26 38.1,52.07 37.47,52.07 36.83,52.7 36.83,60.96 v88.27,60.96 | v106.05,68.58 v91.44,68.58
N$5  (via drill 0.81)
  Top 0.813: E9.12 97.79,13.97 97.79,10.79 98.42,10.16 98.42,6.35 95.89,3.81 72.39,3.81 62.87,13.34 v62.87,33.02 | v69.22,39.37 71.75,41.91 v71.75,45.72 | E6.15 v86.36,49.53
  Bottom 0.813: v69.22,39.37 v62.87,33.02 | v71.75,45.72 75.56,49.53 v86.36,49.53
N$6  (via drill 0.81)
  Top 0.406: v97.79,75.56 100.33,78.11 v100.33,83.82
  Bottom 0.406: E5.14 90.17,72.39 92.71,72.39 | E5.12 92.71,72.39 | 92.71,72.39 95.89,75.56 v97.79,75.56 | v100.33,83.82 117.47,83.82 U$1.AS2
N$7  (via drill 0.81)
  Top 0.406: E5.16 83.82,81.92 82.55,83.19 v82.55,85.09 | v109.86,82.55 111.12,83.82 117.47,83.82 U$1.AS1
  Bottom 0.406: E5.18 80.01,72.39 82.55,72.39 E5.16 | v82.55,85.09 84.45,85.09 85.09,84.45 85.09,82.55 v109.86,82.55
N$8  (via drill 0.81)
  Top 0.406: E5.5 82.55,64.77 v82.55,81.28
  Bottom 0.406: E5.3 80.01,64.77 82.55,64.77 E5.5 | v82.55,81.28 110.49,81.28 111.12,80.64 117.47,80.64 U$1.AT2
N$9  (via drill 0.81)
  Top 0.406: E5.9 93.98,69.22 95.25,70.48 v95.25,72.39
  Bottom 0.406: E5.7 90.17,62.23 92.71,62.23 E5.9 | v95.25,72.39 96.52,73.66 103.5,73.66 106.68,76.83 117.47,76.83 U$1.AU2
N$10
  Top 0.406: Q1.2 R3.2
NO_SHIFT  (via drill 0.81)
  Top 0.406: E2.5 83.82,107.31 85.09,108.58 85.09,109.86 83.82,111.12 E1.5 | v109.22,117.47 111.12,115.57 117.47,115.57 U$1.AE1
  Bottom 0.406: E1.5 85.72,117.47 v109.22,117.47
PC2_H  (via drill 0.81)
  Top 0.406: v45.72,50.8 E7.18 | E7.9 v60.96,50.8 | v66.67,70.48 v66.67,54.61 | v81.28,78.11 v81.28,74.3 | v102.87,80.01 110.49,87.63 110.49,88.9 111.12,89.53 117.47,89.53 U$1.AP1
  Bottom 0.406: v45.72,50.8 v60.96,50.8 62.23,52.07 64.14,52.07 v66.67,54.61 | v66.67,70.48 70.48,74.3 v81.28,74.3 | v81.28,78.11 83.19,80.01 v102.87,80.01
PC2_L  (via drill 0.81)
  Top 0.406: v58.42,58.42 58.42,81.92 59.69,83.19 59.69,113.67 57.15,116.2 v57.15,123.19 | v99.69,125.73 100.97,124.46 100.97,111.12 101.6,110.49 101.6,95.25 100.33,93.98 v100.33,90.17
  Bottom 0.406: E7.16 55.88,58.42 v58.42,58.42 | v57.15,123.19 89.53,123.19 92.08,125.73 v99.69,125.73 | v100.33,90.17 103.5,87 117.47,87 U$1.AR2
PC3_H  (via drill 0.81)
  Top 0.406: v59.69,52.07 59.69,81.92 60.96,83.19 E4.9 | v108.58,93.98 108.58,93.34 117.47,93.34 U$1.AN1 | v66.67,94.61 64.77,92.71 v64.77,85.09
  Bottom 0.406: E7.19 44.45,52.07 v59.69,52.07 | v108.58,93.98 107.95,94.61 v66.67,94.61 | v64.77,85.09 62.23,85.09 E4.9
PC3_L  (via drill 0.81)
  Top 0.406: v43.18,55.24 43.18,81.92 44.45,83.19 v44.45,94.61 | v104.14,93.34 v104.14,100.97
  Bottom 0.406: E7.17 46.35,55.24 v43.18,55.24 | v44.45,94.61 50.16,100.33 97.79,100.33 98.42,100.97 v104.14,100.97 | v104.14,93.34 107.31,90.17 117.47,90.17 U$1.AP2
PC_ENABL  (via drill 0.81)
  Top 0.406: E4.5 49.53,82.55 49.53,52.7 50.8,51.44 E7.5 52.7,43.81 v52.7,24.13
  Bottom 0.406: v52.7,24.13 60.33,16.51 71.75,16.51 73.03,15.24 102.23,15.24 103.5,13.97 117.47,13.97 U$1.BS2
SC2  (via drill 0.81)
  Top 0.406: E8.16 85.09,36.83 85.09,53.98 92.71,61.59 v95.25,61.59 | v107.31,61.59 107.95,60.96 107.95,52.07 111.12,48.9 117.47,48.9 U$1.BD1
  Bottom 0.406: v107.31,61.59 v95.25,61.59
SC3  (via drill 0.81)
  Top 0.406: E9.16 83.82,12.06 85.09,10.79 v85.09,8.89 | v99.69,8.89 100.33,9.53 v100.33,23.5 | v109.86,23.5 117.47,23.5 U$1.BN1
  Bottom 0.406: v99.69,8.89 v85.09,8.89 | v109.86,23.5 v100.33,23.5
SC_ENABL  (via drill 0.81)
  Top 0.406: E9.6 86.36,15.88 85.09,17.14 85.09,19.05 86.36,20.32 E8.6 87,28.57 v87,31.75 | v100.97,37.47 102.23,38.73 v102.23,42.55
  Bottom 0.406: v87,31.75 89.53,34.29 94.61,34.29 95.25,34.92 95.25,37.47 v100.97,37.47 | v102.23,42.55 117.47,42.55 U$1.BF2
SHIFT_L1  (via drill 0.81)
  Top 0.406: E2.6 86.36,107.31 87.63,108.58 87.63,109.86 86.36,111.12 v86.36,113.67 E1.6
  Bottom 0.406: v86.36,113.67 109.86,113.67 111.12,112.39 117.47,112.39 U$1.AF2
SHIFT_L2  (via drill 0.81)
  Top 0.406: E2.7 90.17,102.87 v90.17,106.68 90.17,109.86 88.9,111.12 E1.7 | v109.86,107.95 111.12,109.22 117.47,109.22 U$1.AH1
  Bottom 0.406: v90.17,106.68 97.16,106.68 98.42,107.95 v109.86,107.95
SHIFT_R1  (via drill 0.81)
  Top 0.406: E2.4 82.55,102.87 82.55,109.86 81.28,111.12 E1.4 | v102.23,114.94 104.78,117.47 v104.78,118.75
  Bottom 0.406: E1.4 85.72,114.94 v102.23,114.94 | v104.78,118.75 117.47,118.75 U$1.AD2
SHIFT_R2  (via drill 0.81)
  Top 0.406: E2.3 78.74,105.41 80.01,106.68 80.01,118.11 E1.3 80.01,120.65 v80.01,129.54 | v108.58,129.54 108.58,120.02 109.86,118.75 117.47,118.75 U$1.AD1
  Bottom 0.406: v108.58,129.54 v80.01,129.54
SR2  (via drill 0.81)
  Top 0.406: E8.15 87.63,34.29 90.17,34.29 90.17,43.18 90.81,43.81 v93.98,43.81 | v109.86,43.81 111.12,45.09 117.47,45.09 U$1.BE1
  Bottom 0.406: v109.86,43.81 v93.98,43.81
SR3  (via drill 0.81)
  Top 0.406: v97.79,16.51 97.79,32.38 103.5,38.1 103.5,45.72 v104.14,46.35
  Bottom 0.406: E9.15 87.63,16.51 v97.79,16.51 | v104.14,46.35 106.05,48.26 117.47,48.26 U$1.BD2
SR_ENABL  (via drill 0.81)
  Top 0.406: E9.5 82.55,8.89 80.01,8.89 80.01,14.61 77.47,17.14 v77.47,29.21 | v92.71,29.21 92.71,38.1 95.25,40.64 v95.25,49.53 | v103.5,52.07 v100.97,49.53 | v109.86,52.07 117.47,52.07 U$1.BC1
  Bottom 0.406: v77.47,29.21 82.55,29.21 E8.5 85.09,29.21 v92.71,29.21 | v100.97,49.53 v95.25,49.53 | v109.86,52.07 v103.5,52.07
TT_SHIFT  (via drill 0.81)
  Top 0.406: R5.1 Q1.3 | E2.8 91.44,107.31 92.71,108.58 v92.71,111.12 92.71,118.11 E1.8
  Bottom 0.406: R5.1 84.45,111.76 85.09,111.12 v92.71,111.12
TT_SHIFT_L  (via drill 0.81)
  Top 0.406: R4.1 R3.1 | v92.71,121.92 93.98,123.19 v93.98,124.46
  Bottom 0.406: R4.1 54.61,120.65 88.27,120.65 89.53,121.92 v92.71,121.92 | v93.98,124.46 117.47,124.46 U$1.AB2
VCC  (via drill 0.81)
  Top 0.813: C2P.+ 101.6,90.17 101.6,87 | 101.6,87 101.6,77.47 100.97,76.83 100.97,66.67 102.87,64.77 C3P.+ | v106.05,125.73 107.31,124.46 107.31,92.71 101.6,87 | 40.01,91.44 C4.1 | 45.72,99.06 R2.2 | 45.72,99.06 40.64,99.06 E4.20 40.01,91.44 | C7.1 38.1,84.45 40.01,86.36 40.01,91.44 | E8.20 C8.1 | E9.20 73.66,21.59 v76.2,24.13 | v66.67,21.59 v66.67,33.02 v66.67,48.9 | E1.20 C1.1 69.22,125.09 69.22,107.31 | R6.2 R4.2 48.9,125.09 48.9,102.23 45.72,99.06 | E2.20 C2.1 69.22,107.31 | E3.20 C3.1 69.22,89.53 | C6.1 69.22,55.24 69.22,69.22 | C5.1 69.22,69.22 | 69.22,69.22 69.22,89.53 | 69.22,89.53 69.22,107.31
  Bottom 0.813: C1P.+ 104.14,128.27 106.05,128.27 | 106.05,128.27 117.47,128.27 U$1.AA2 | U$1.BA2 117.47,58.42 108.58,58.42 108.58,62.23 107.95,62.87 103.5,62.87 C3P.+ 99.06,67.31 77.47,67.31 E5.20 C5.1 | v106.05,125.73 106.05,128.27 | E7.20 39.37,53.34 | 39.37,53.34 C7.1 | R1.2 50.16,56.52 42.55,56.52 39.37,53.34 | E9.20 C9.1 70.48,17.78 v66.67,21.59 | v76.2,24.13 76.83,23.5 98.42,23.5 100.33,25.4 C4P.+ | C8.1 68.58,33.02 v66.67,33.02 | R6.2 C1.1 | E6.20 C6.1 v66.67,48.9

### Text on the board
Bottom: MAJOR REGISTERS M220P16